# EAGLE schematic CrackberryPi_1.0.4 (EAGLE 6.5.0)
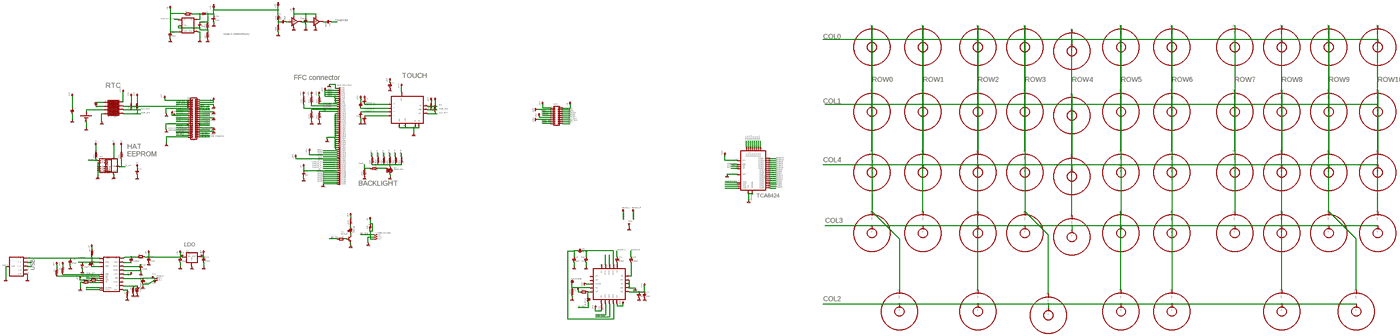
[diagram p0: schematic, sheet 1, overview]
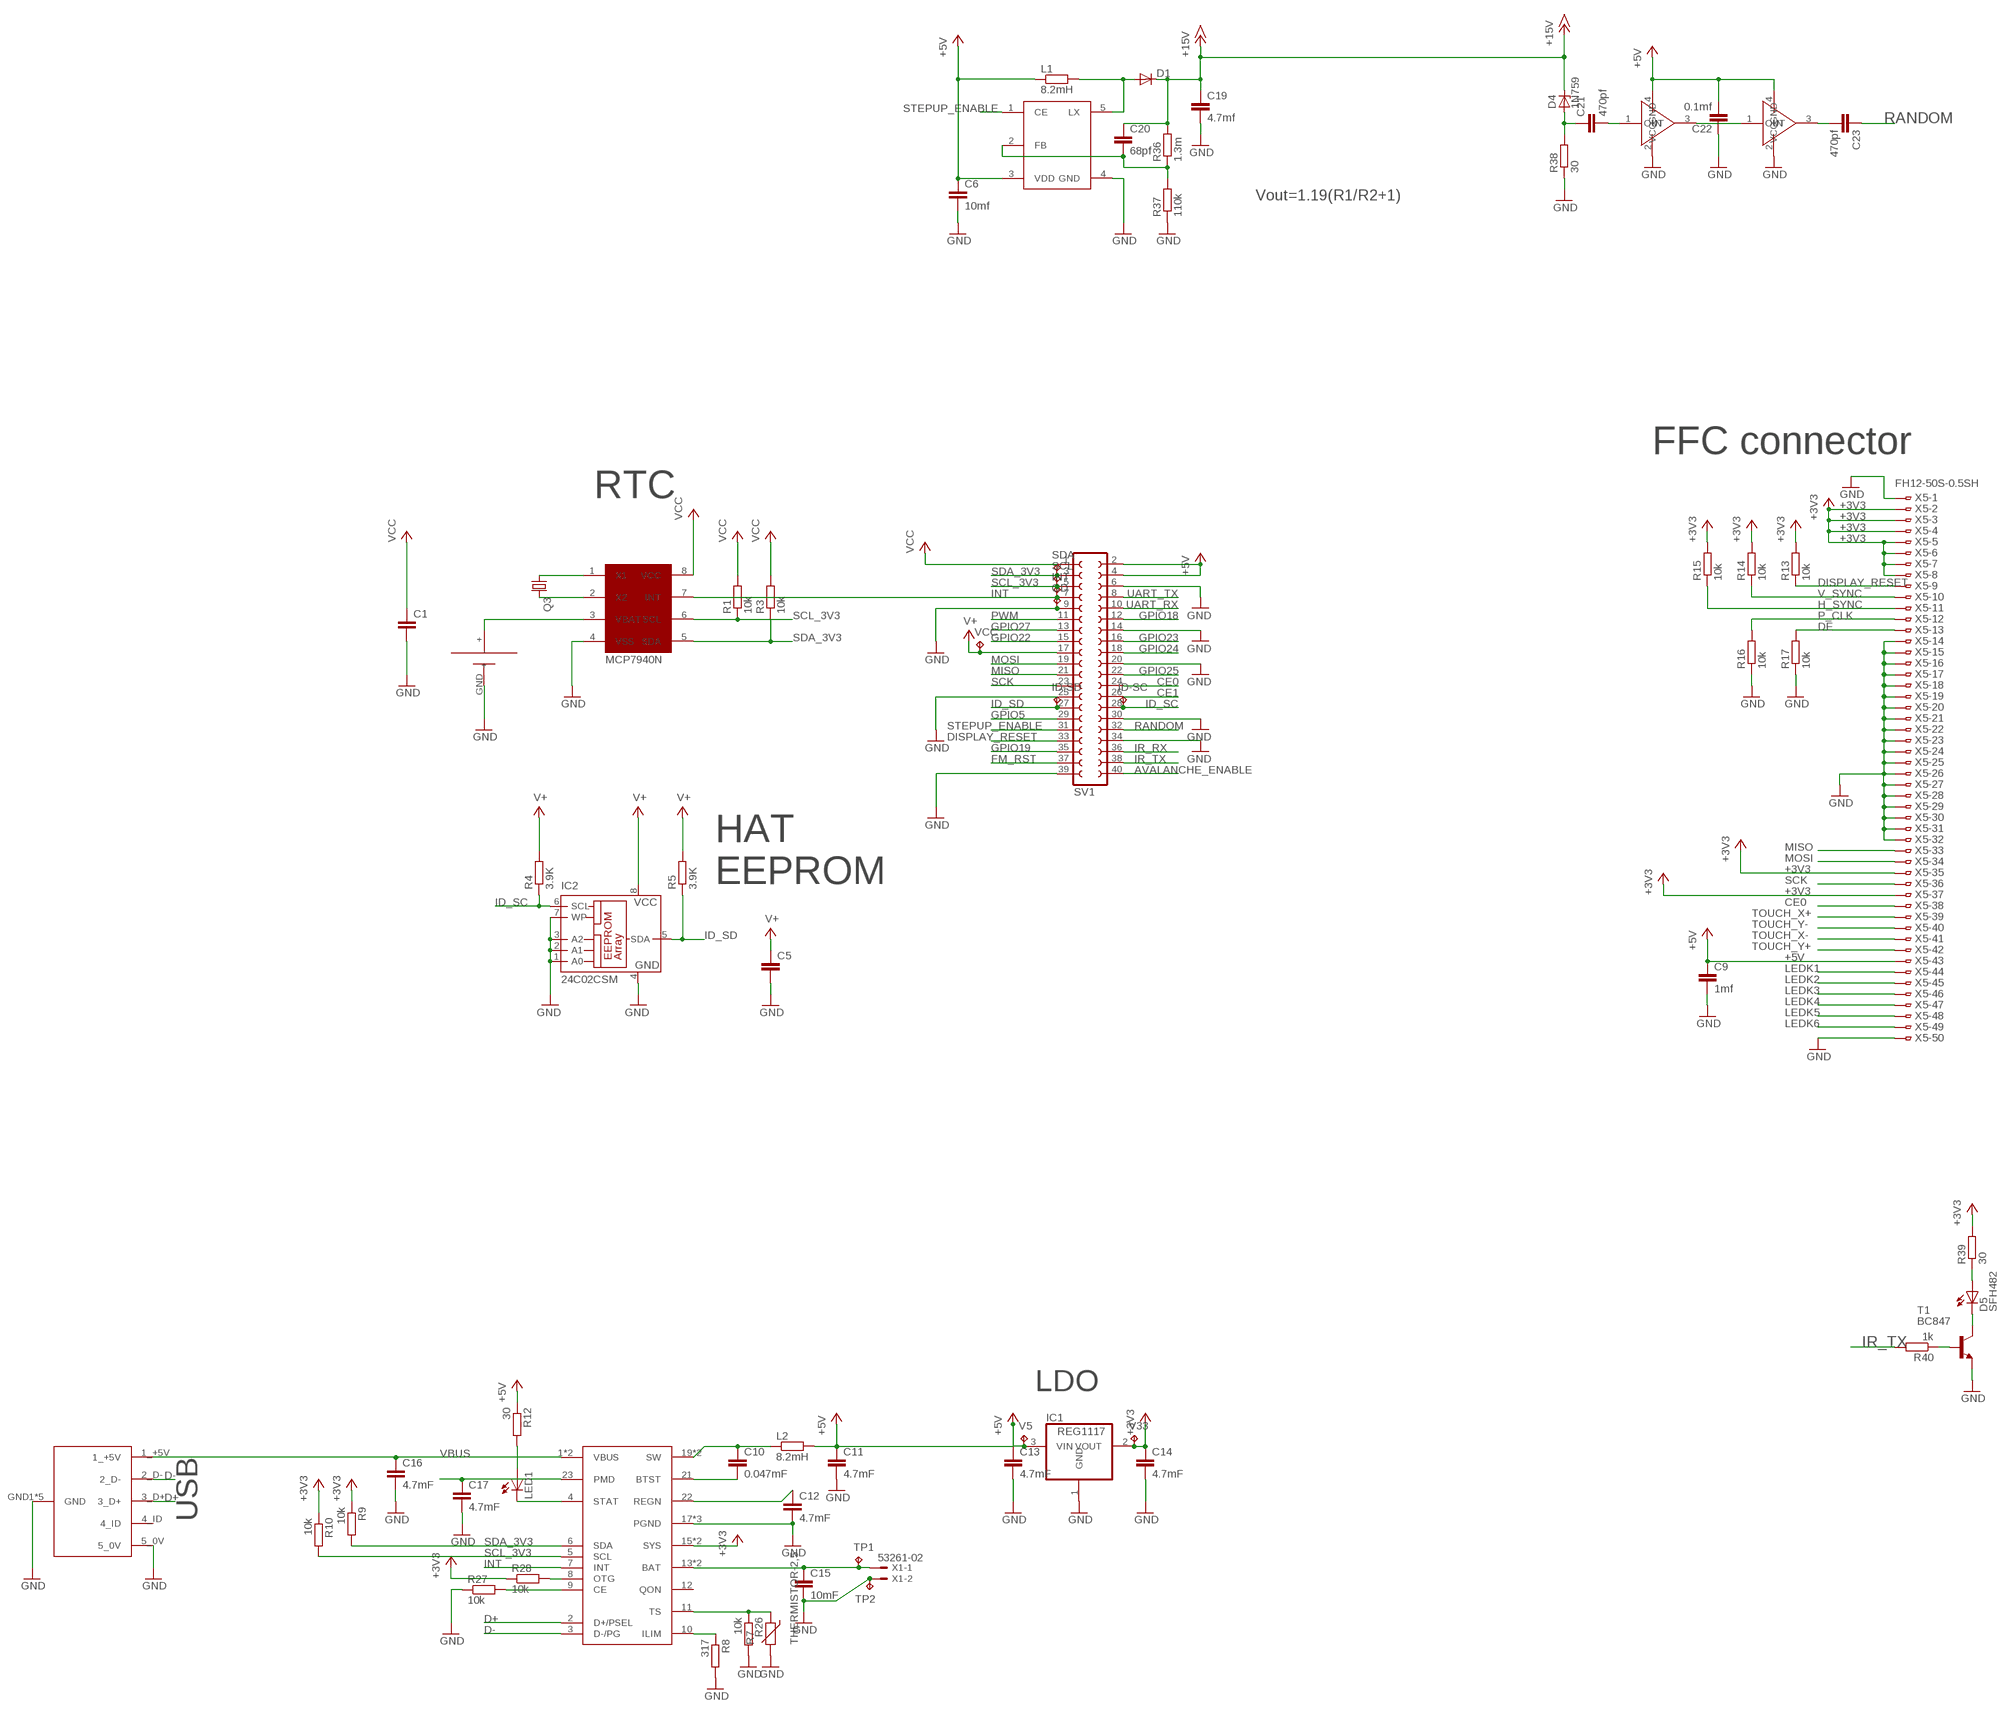
[diagram p1: schematic, sheet 1, part 1 of 4]
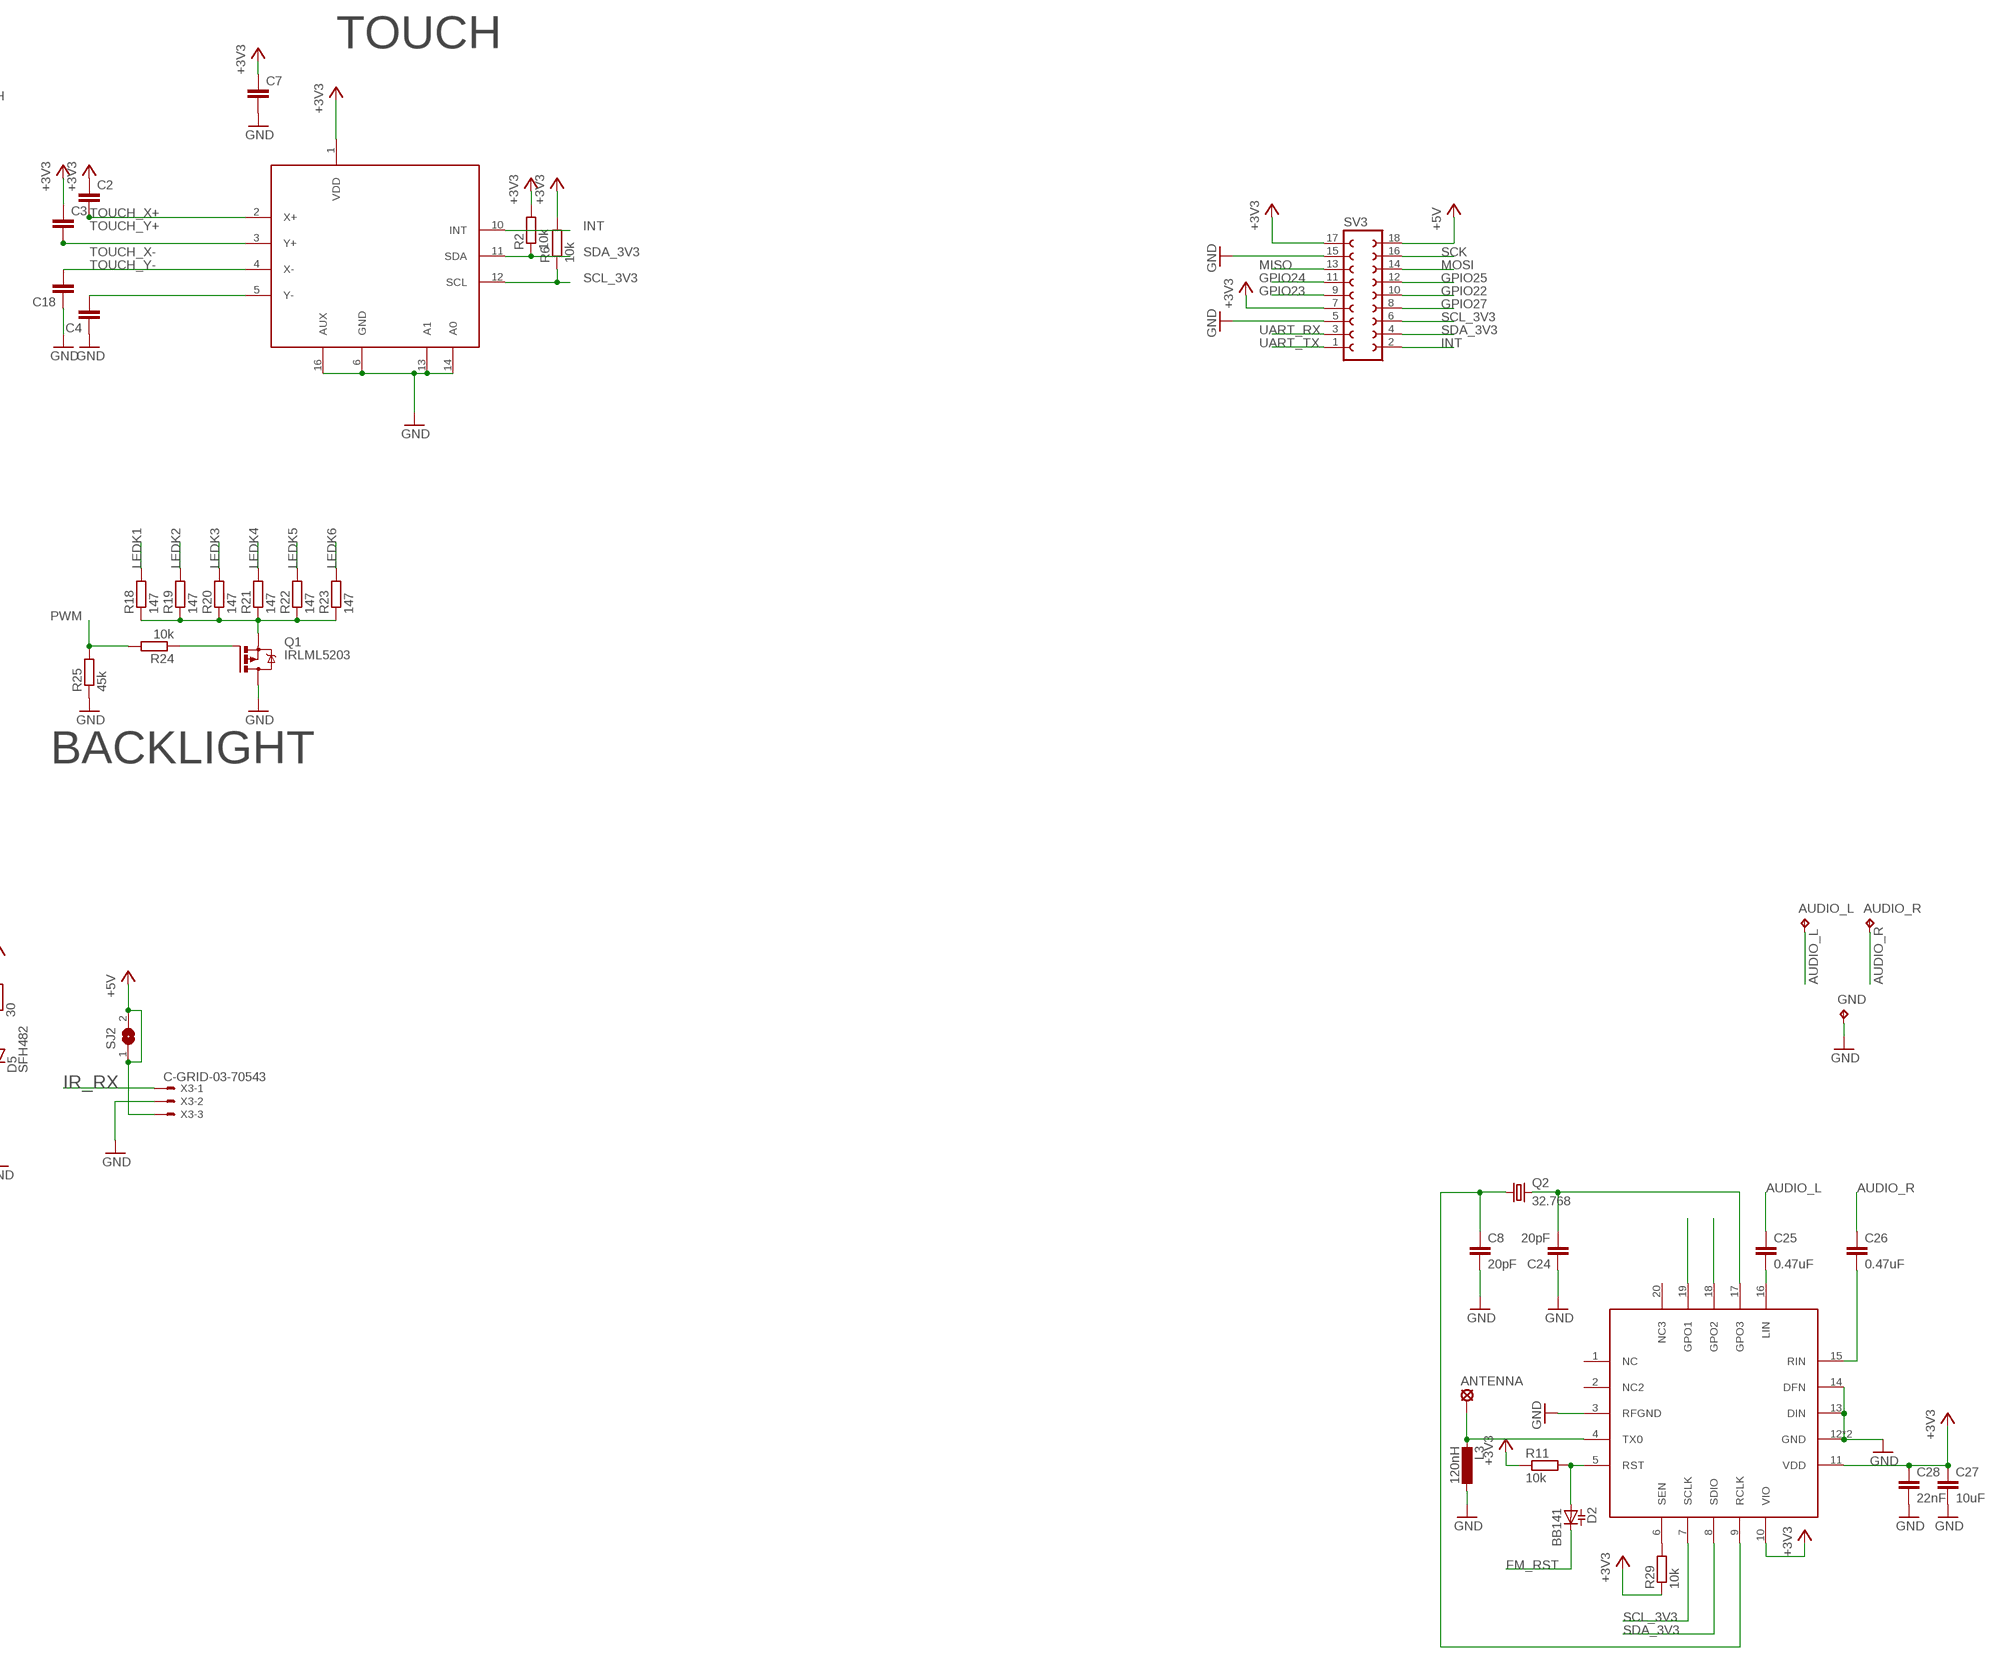
[diagram p2: schematic, sheet 1, part 2 of 4]
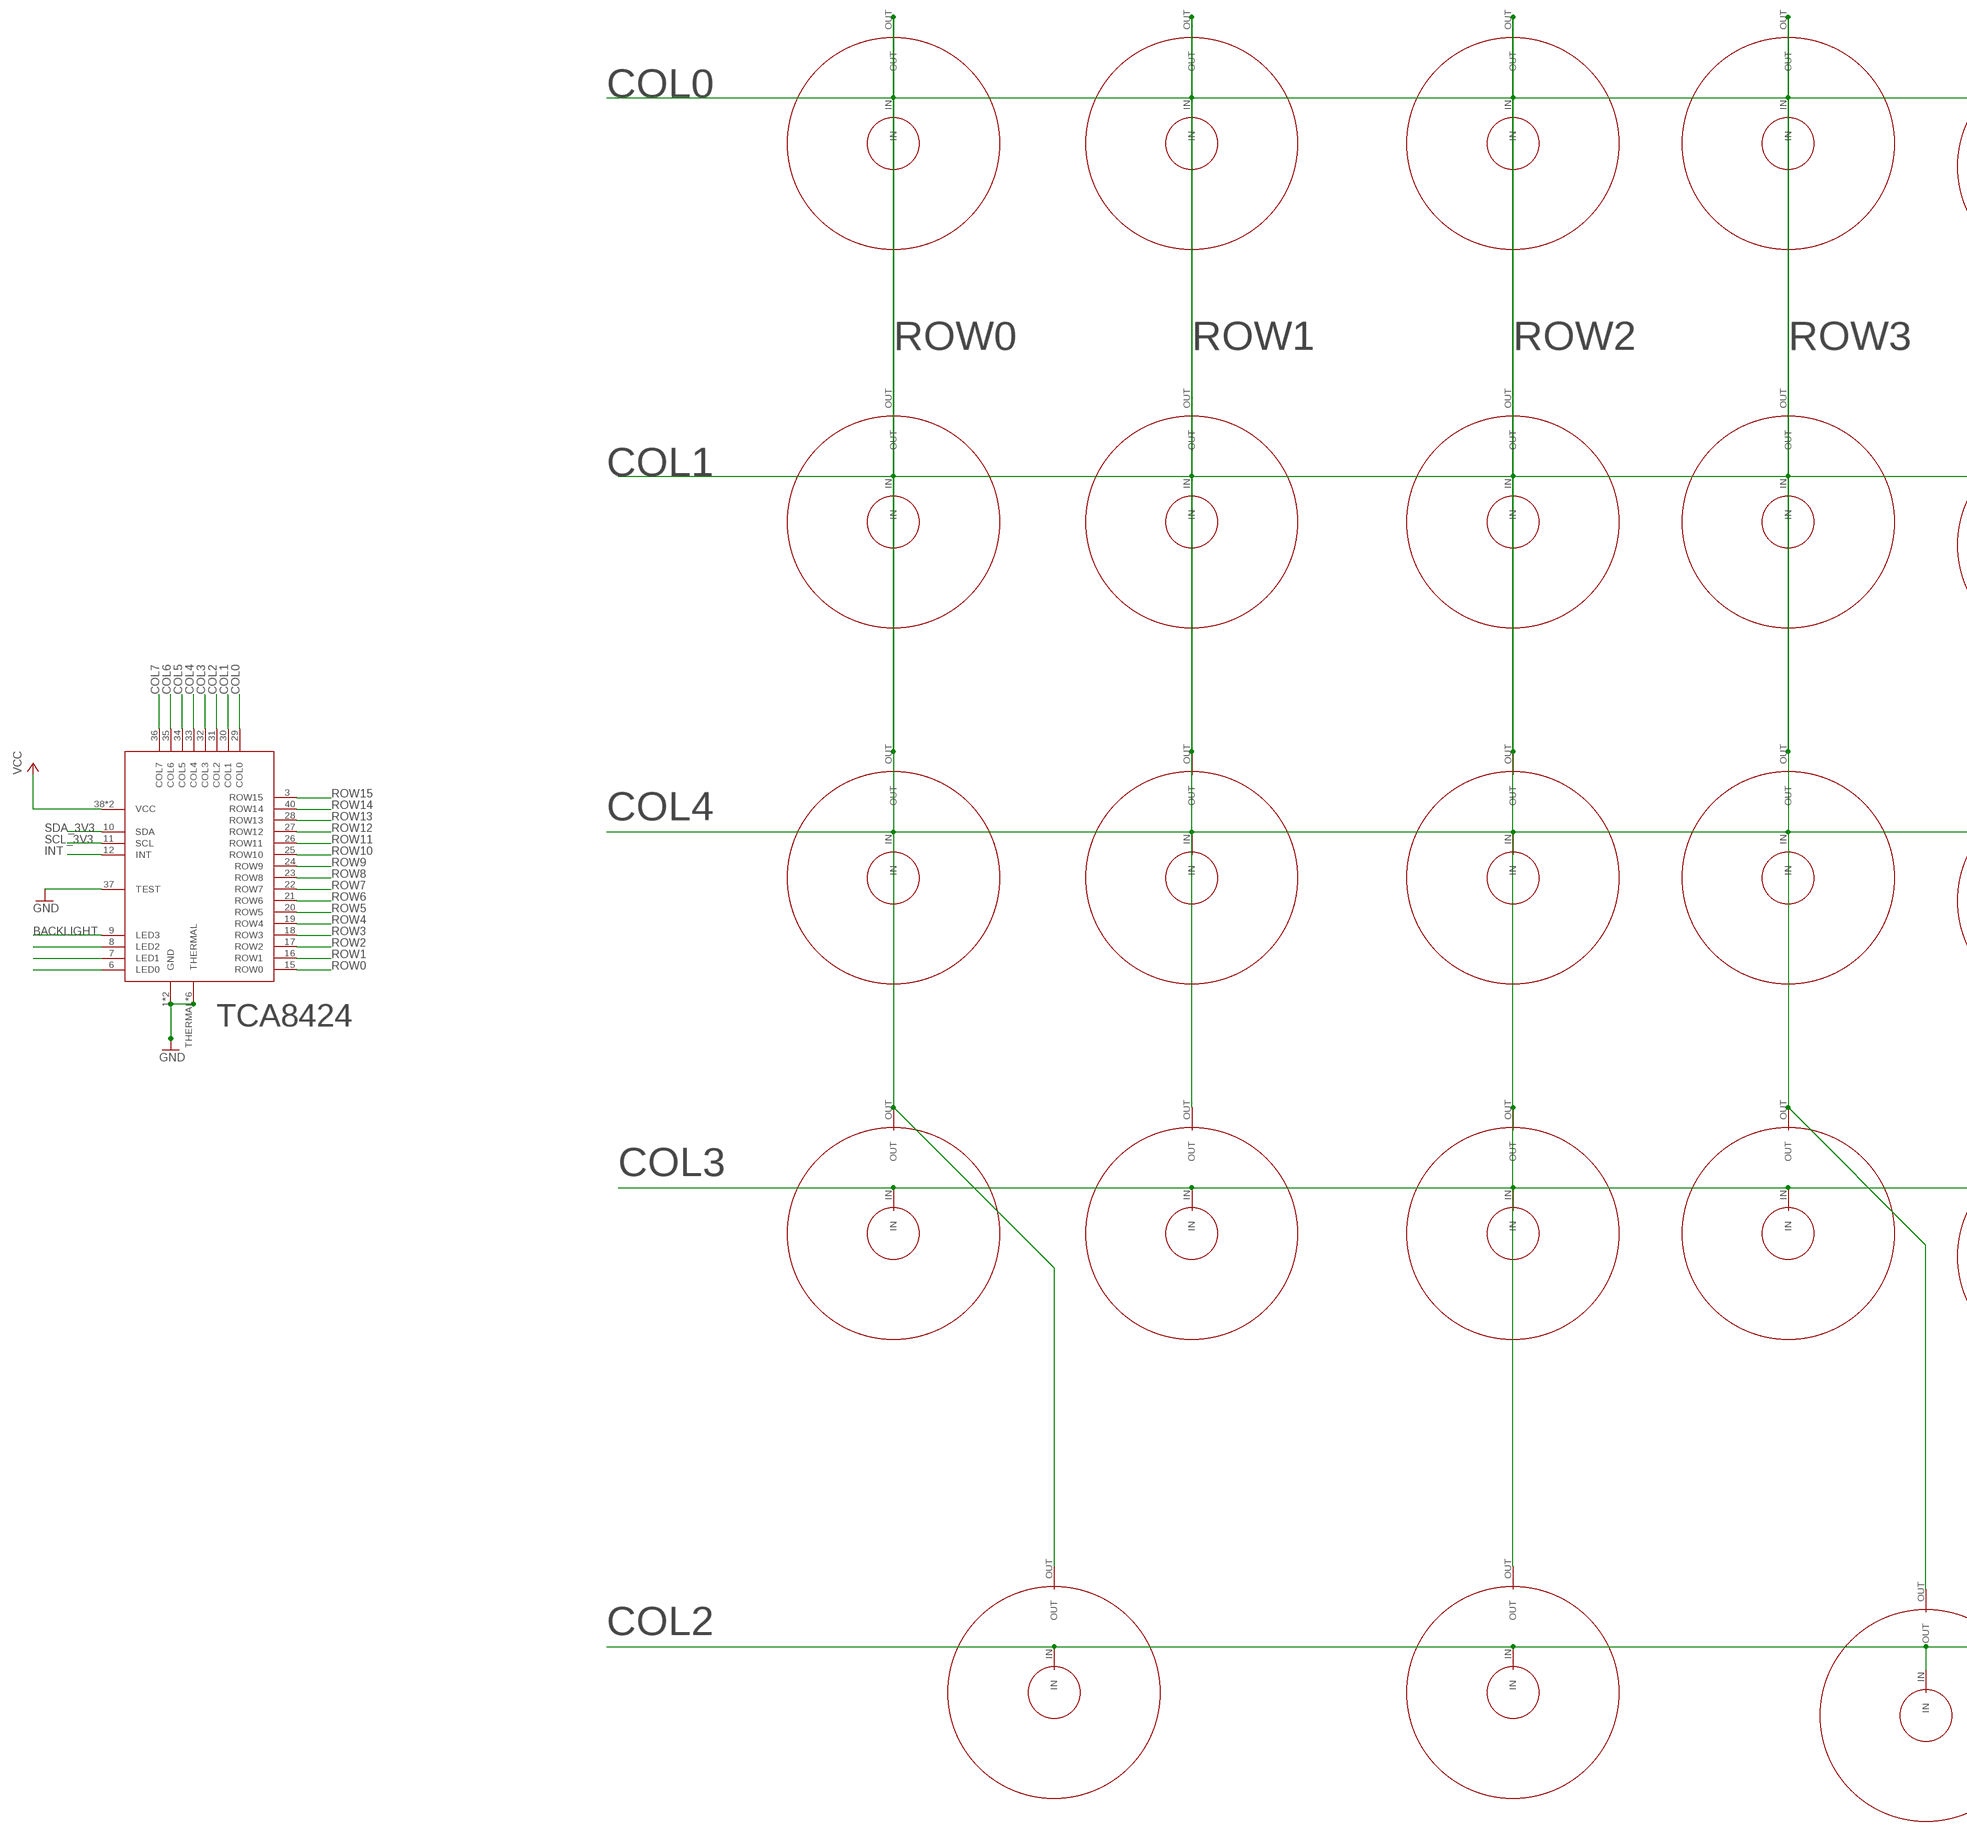
[diagram p3: schematic, sheet 1, part 3 of 4]
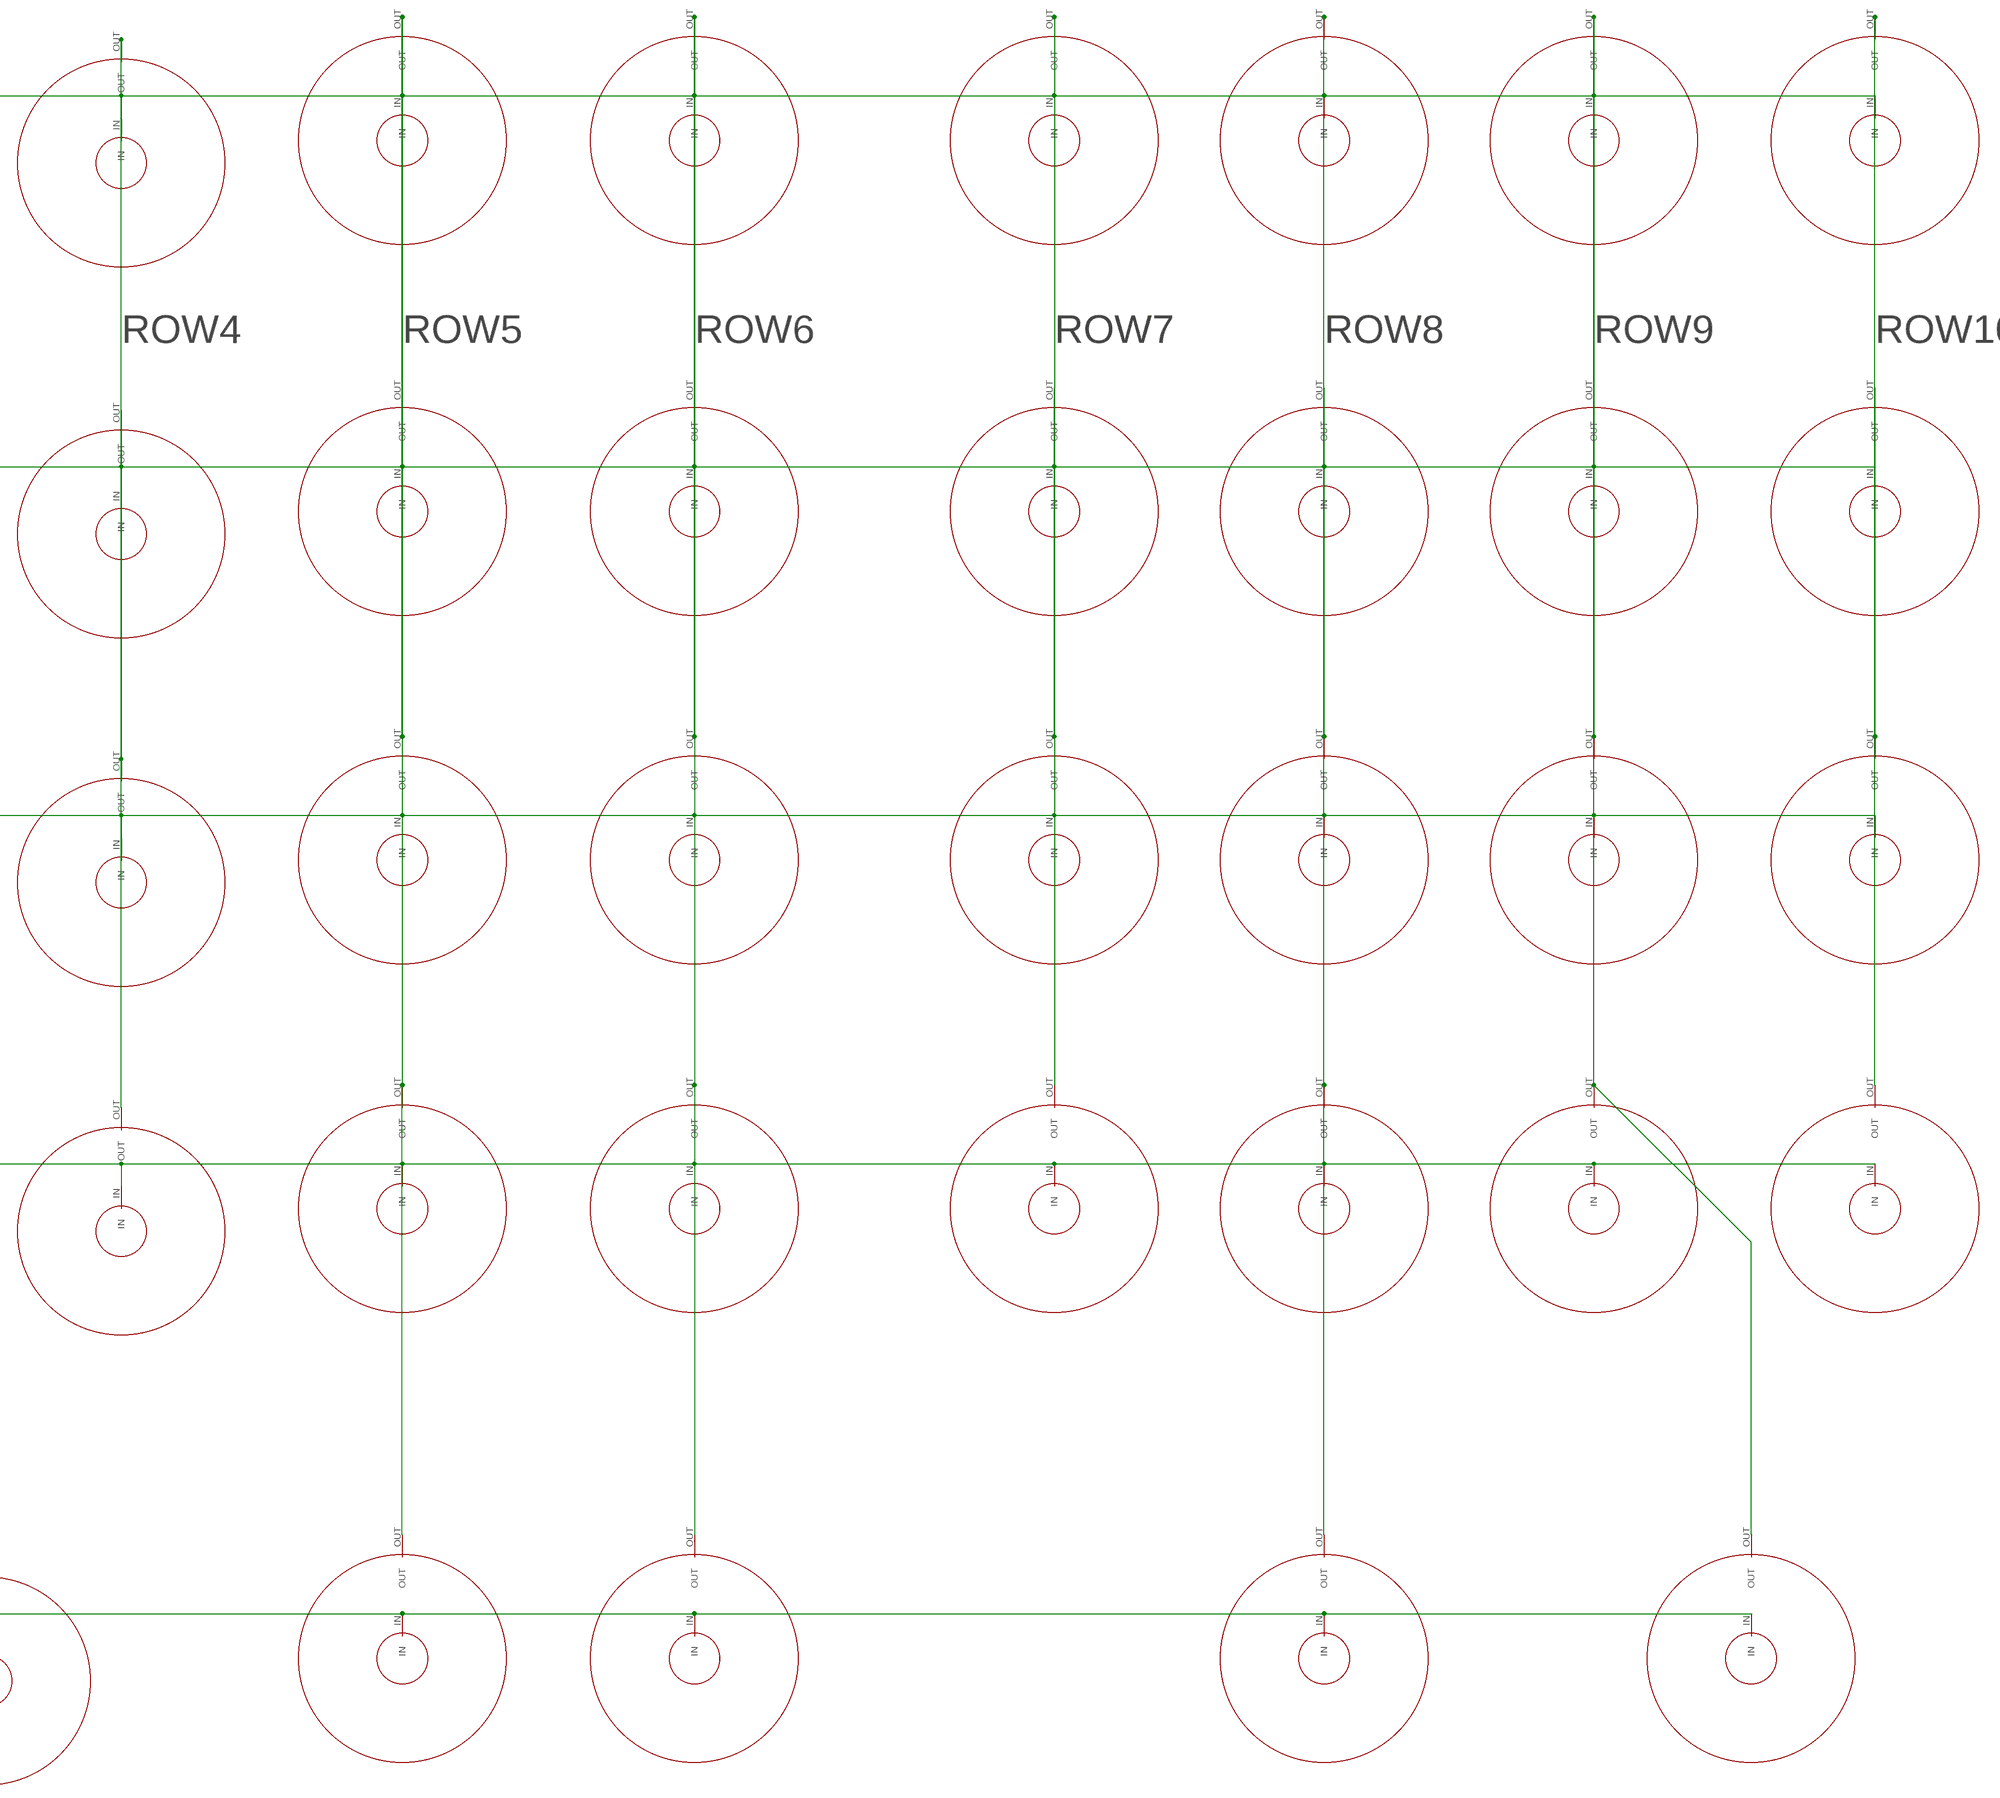
[diagram p4: schematic, sheet 1, part 4 of 4]

## Parts
0  DOME  [4MM]
1  DOME  [4MM]
2  DOME  [4MM]
3  DOME  [4MM]
4  DOME  [4MM]
5  DOME  [4MM]
6  DOME  [4MM]
7  DOME  [4MM]
8  DOME  [4MM]
9  DOME  [4MM]
!  DOME  [4MM]
(  DOME  [4MM]
)  DOME  [4MM]
+  DOME  [4MM]
,  DOME  [4MM]
-  DOME  [4MM]
.  DOME  [4MM]
?  DOME  [4MM]
@  DOME  [4MM]
A  DOME  [4MM]
ANTENNA  LSP10  [LSP10]
AUDIO_L  TPB2,54  [B2,54]
AUDIO_R  TPB2,54  [B2,54]
B  DOME  [4MM]
C  DOME  [4MM]
C1  C-EUC0603  [C0603]
C2  C-EUC0603  [C0603]
C3  C-EUC0603  [C0603]
C4  C-EUC0603  [C0603]
C5  C-EUC0603  [C0603]
C6  10mf  C-EUC0603  [C0603]
C7  C-EUC0603  [C0603]
C8  20pF  C-EUC0603  [C0603]
C9  1mf  C-EUC0603  [C0603]
C10  0.047mF  C-EUC0603  [C0603]
C11  4.7mF  C-EUC0603  [C0603]
C12  4.7mF  C-EUC0603  [C0603]
C13  4.7mF  C-EUC0603  [C0603]
C14  4.7mF  C-EUC0603  [C0603]
C15  10mF  C-EUC0603  [C0603]
C16  4.7mF  C-EUC0603  [C0603]
C17  4.7mF  C-EUC0603  [C0603]
C18  C-EUC0603  [C0603]
C19  4.7mf  C-EUC0603  [C0603]
C20  68pf  C-EUC0603  [C0603]
C21  470pf  C-EUC0603  [C0603]
C22  0.1mf  C-EUC0603  [C0603]
C23  470pf  C-EUC0603  [C0603]
C24  20pF  C-EUC0603  [C0603]
C25  0.47uF  C-EUC0603  [C0603]
C26  0.47uF  C-EUC0603  [C0603]
C27  10uF  C-EUC0603  [C0603]
C28  22nF  C-EUC0603  [C0603]
D  DOME  [4MM]
D1  DIODE-SOD123  [SOD123]
D2  BB141  [SOD523]
D4  1N759  ZENER-DIODESOD80C  [SOD80C]
D5  SFH482  [SFH482]
E  DOME  [4MM]
F  DOME  [4MM]
FN-RIGHT  DOME  [4MM]
G  DOME  [4MM]
GD  TPB1,27  [B1,27]
GND  TPB2,54  [B2,54]
H  DOME  [4MM]
I  DOME  [4MM]
IC1  REG1117  [SOT223]
IC2  24C02CSM  [SO-08M]
ID-SC  TPB1,27  [B1,27]
ID-SD  TPB1,27  [B1,27]
INT  TPB1,27  [B1,27]
J  DOME  [4MM]
K  DOME  [4MM]
L  DOME  [4MM]
L1  8.2mH  R-EU_R1206W  [R1206W]
L2  8.2mH  R-EU_R1206W  [R1206W]
L3  120nH  L-EUL2012C  [L2012C]
LED1  LEDSML0603  [SML0603]
M  DOME  [4MM]
N  DOME  [4MM]
O  DOME  [4MM]
P  DOME  [4MM]
Q  DOME  [4MM]
Q1  IRLML5203  [MICRO3]
Q2  32.768  CRYSTALMM20SS  [MM20SS]
Q3  CRYSTALMM20SS  [MM20SS]
R  DOME  [4MM]
R1  10k  R-EU_R0603  [R0603]
R2  10k  R-EU_R0603  [R0603]
R3  10k  R-EU_R0603  [R0603]
R4  3.9K  R-EU_R0603  [R0603]
R5  3.9K  R-EU_R0603  [R0603]
R6  10k  R-EU_R0603  [R0603]
R7  THERMISTOR-2,5  [RS-2,5]
R8  317  R-EU_R0603  [R0603]
R9  10k  R-EU_R0603  [R0603]
R10  10k  R-EU_R0603  [R0603]
R11  10k  R-EU_R0603  [R0603]
R12  30  R-EU_R0603  [R0603]
R13  10k  R-EU_R0603  [R0603]
R14  10k  R-EU_R0603  [R0603]
R15  10k  R-EU_R0603  [R0603]
R16  10k  R-EU_R0603  [R0603]
R17  10k  R-EU_R0603  [R0603]
R18  147  R-EU_R0603  [R0603]
R19  147  R-EU_R0603  [R0603]
R20  147  R-EU_R0603  [R0603]
R21  147  R-EU_R0603  [R0603]
R22  147  R-EU_R0603  [R0603]
R23  147  R-EU_R0603  [R0603]
R24  10k  R-EU_R0603  [R0603]
R25  45k  R-EU_R0603  [R0603]
R26  10k  R-EU_R0603  [R0603]
R27  10k  R-EU_R0603  [R0603]
R28  10k  R-EU_R0603  [R0603]
R29  10k  R-EU_R0603  [R0603]
R36  1.3m  R-EU_R0603  [R0603]
R37  110k  R-EU_R0603  [R0603]
R38  30  R-EU_R0603  [R0603]
R39  30  R-EU_R0603  [R0603]
R40  1k  R-EU_R0603  [R0603]
S  DOME  [4MM]
SCL  TPB1,27  [B1,27]
SDA  TPB1,27  [B1,27]
SHIFT-RIGHT  DOME  [4MM]
SHILFT-LEFT  DOME  [4MM]
SJ2  SJ  [SJ]
SPACE1  DOME  [4MM]
SPACE2  DOME  [4MM]
SPACE3  DOME  [4MM]
SV1  FE20-2  [FE20-2]
SV3  FE09-2  [FE09-2]
T  DOME  [4MM]
T1  BC847  [SOT23]
TP1  TPTP20SQ  [TP20SQ]
TP2  TPTP20SQ  [TP20SQ]
U  DOME  [4MM]
U$1  BQ24297  [VQFN-4X4-24]
U$2  NCP1406  [SOT23-5L]
U$3  MAX2650  [SOT143-W]
U$4  CR1216  [CR1216]
U$5  MCP7940N  [SO08]
U$6  TSC2007  [TSSOP16]
U$7  TCA8424  [QFN40]
U$8  SI4713  [QFN20-3X3]
U$9  MICRO_USB  [MICRO_USB]
U$10  MAX2650  [SOT143-W]
V  DOME  [4MM]
V5  TPB1,27  [B1,27]
V33  TPB1,27  [B1,27]
VCC  TPB1,27  [B1,27]
W  DOME  [4MM]
X  DOME  [4MM]
X1  53261-02  [53261-02]
X3  C-GRID-03-70543  [70543-03]
X5  FH12-50S-0.5SH  [FH12-50S-0.5SH]
Y  DOME  [4MM]
Z  DOME  [4MM]

## Nets
+3V3: C2.1 C3.1 C7.1 C14.1 C27.1 C28.1 IC1.2(VOUT) R2.2 R6.2 R9.1 R10.1 R11.1 R13.2 R14.2 R15.2 R28.1 R29.1 R39.2 SV3.7 SV3.17 U$1.15(SYS) U$1.16(SYS) U$6.1(VDD) U$8.10(VIO) U$8.11(VDD) V33.TP X5.2 X5.3 X5.4 X5.5 X5.6 X5.7 X5.8 X5.35 X5.37
+5V: C6.1 C9.1 C11.1 C13.1 C22.2 IC1.3(VIN) L1.1 L2.2 R12.1 SJ2.1 SJ2.2 SV1.2 SV1.4 SV3.18 U$2.3(VDD) U$3.4(VCC) U$10.4(VCC) V5.TP X3.3 X5.43
+15V: C19.1 C20.1 D1.C D4.C R36.2
AUDIO_L: AUDIO_L.TP C25.1
AUDIO_R: AUDIO_R.TP C26.1
AVALANCHE_ENABLE: SV1.40
BACKLIGHT: U$7.9(LED3)
BASE: R40.1 T1.1(B)
CE0: SV1.24 X5.38
CE1: SV1.26
COL0: 0.IN 1.IN 2.IN 3.IN 4.IN 5.IN 6.IN 7.IN 8.IN 9.IN -.IN U$7.29(COL0)
COL1: +.IN E.IN I.IN O.IN P.IN Q.IN R.IN T.IN U$7.30(COL1) U.IN W.IN Y.IN
COL2: @.IN FN-RIGHT.IN SHIFT-RIGHT.IN SHILFT-LEFT.IN SPACE1.IN SPACE2.IN SPACE3.IN U$7.31(COL2)
COL3: !.IN ,.IN ..IN ?.IN B.IN C.IN M.IN N.IN U$7.32(COL3) V.IN X.IN Z.IN
COL4: (.IN ).IN A.IN D.IN F.IN G.IN H.IN J.IN K.IN L.IN S.IN U$7.33(COL4)
COL5: U$7.34(COL5)
COL6: U$7.35(COL6)
COL7: U$7.36(COL7)
COLLECTOR: D5.K(C) T1.3(C)
D+: U$1.2(D+/PSEL) U$9.3_D+
D-: U$1.3(D-/PG) U$9.2_D-
DE: R17.2 X5.13
DISPLAY_RESET: R13.1 SV1.33 X5.9
EMITTER: T1.2(E) ; supply symbol labelled GND
FB: C20.2 R36.1 R37.2 U$2.2(FB)
FM_RST: D2.C SV1.37
GND: C1.2 C4.1 C5.2 C6.2 C7.2 C8.2 C9.2 C11.2 C12.2 C13.2 C14.2 C15.2 C16.2 C17.2 C18.1 C19.2 C22.1 C24.1 C27.2 C28.2 GD.TP GND.TP IC1.1(GND) IC2.1(A0) IC2.2(A1) IC2.3(A2) IC2.4(GND) IC2.7(WP) L3.1 Q1.3(D) R7.2 R8.2 R16.1 R17.1 R25.1 R26.2 R27.1 R37.1 R38.1 SV1.6 SV1.9 SV1.14 SV1.20 SV1.25 SV1.30 SV1.34 SV1.39 SV3.5 SV3.15 TP2.TP U$1.17(PGND) U$1.18(PGND) U$1.P$1(PGND) U$2.4(GND) U$3.2(GND) U$4.GND(-) U$5.4(VSS) U$6.6(GND) U$6.13(A1) U$6.14(A0) U$6.16(AUX) U$7.1(GND) U$7.4(GND) U$7.37(TEST) U$7.THERMAL U$7.VIA1(THERMAL) U$7.VIA2(THERMAL) U$7.VIA3(THERMAL) U$7.VIA4(THERMAL) U$7.VIA5(THERMAL) U$8.3(RFGND) U$8.12(GND) U$8.13(DIN) U$8.14(DFN) U$8.P$1(GND) U$9.5_0V U$9.GND1(GND) U$9.GND2(GND) U$9.GND5(GND) U$9.P$1(GND) U$9.P$7(GND) U$10.2(GND) X1.2 X3.2 X5.1 X5.14 X5.15 X5.16 X5.17 X5.18 X5.19 X5.20 X5.21 X5.22 X5.23 X5.24 X5.25 X5.26 X5.27 X5.28 X5.29 X5.30 X5.31 X5.32 X5.50
GPIO5: SV1.29
GPIO18: SV1.12
GPIO19: SV1.35
GPIO22: SV1.15 SV3.10
GPIO23: SV1.16 SV3.9
GPIO24: SV1.18 SV3.11
GPIO25: SV1.22 SV3.12
GPIO27: SV1.13 SV3.8
GPO1: U$8.19(GPO1)
GPO2: U$8.18(GPO2)
H_SYNC: R15.1 X5.11
ID_SC: IC2.6(SCL) ID-SC.TP R4.1 SV1.28
ID_SD: IC2.5(SDA) ID-SD.TP R5.1 SV1.27
IN_1: C21.2 U$3.1(IN)
INT: INT.TP SV1.7 SV3.2 U$1.7(INT) U$5.7(INT) U$6.10(INT) U$7.12(INT)
IR_RX: SV1.36 X3.1
IR_TX: R40.2 SV1.38
LEDK1: R18.2 X5.44
LEDK2: R19.2 X5.45
LEDK3: R20.2 X5.46
LEDK4: R21.2 X5.47
LEDK5: R22.2 X5.48
LEDK6: R23.2 X5.49
LX: D1.A L1.2 U$2.5(LX)
MISO: SV1.21 SV3.13 X5.33
MOSI: SV1.19 SV3.14 X5.34
N$1: C10.1 L2.1 U$1.19(SW) U$1.20(SW)
N$2: C10.2 U$1.21(BTST)
N$3: C15.1 TP1.TP U$1.13(BAT) U$1.14(BAT) X1.1
N$4: LED1.A R12.2
N$5: C12.1 U$1.22(REGN)
N$6: R7.1 R26.1 U$1.11(TS)
N$7: R8.1 U$1.10(ILIM)
N$8: C17.1 U$1.23(PMD)
N$9: LED1.C U$1.4(STAT)
N$10: U$7.6(LED0)
N$11: Q3.1 U$5.1(X1)
N$12: Q1.2(S) R18.1 R19.1 R20.1 R21.1 R22.1 R23.1
N$13: Q3.4 U$5.2(X2)
N$14: U$7.7(LED1)
N$15: R27.2 U$1.9(CE)
N$16: C21.1 D4.A R38.2
N$17: R28.2 U$1.8(OTG)
N$18: U$7.8(LED2)
N$19: C24.2 Q2.4 U$8.17(GPO3)
N$20: Q1.1(G) R24.1
N$21: C8.1 Q2.1 U$8.9(RCLK)
N$22: C25.2 U$8.16(LIN)
N$23: C26.2 U$8.15(RIN)
N$24: D2.A R11.2 U$8.5(RST)
N$25: ANTENNA.MP L3.2 U$8.4(TX0)
N$26: R29.2 U$8.6(SEN)
N$30: D5.A R39.1
OUT1_IN2: U$3.3(OUT) U$10.1(IN)
OUT2: C23.2 U$10.3(OUT)
P_CLK: R16.2 X5.12
PWM: R24.2 R25.2 SV1.11
RANDOM: C23.1 SV1.32
ROW0: 1.OUT A.OUT Q.OUT SHILFT-LEFT.OUT U$7.15(ROW0) Z.OUT
ROW1: 2.OUT S.OUT U$7.16(ROW1) W.OUT X.OUT
ROW2: 3.OUT C.OUT D.OUT E.OUT SPACE1.OUT U$7.17(ROW2)
ROW3: 4.OUT F.OUT R.OUT SPACE2.OUT U$7.18(ROW3) V.OUT
ROW4: 5.OUT B.OUT G.OUT T.OUT U$7.19(ROW4)
ROW5: 6.OUT H.OUT N.OUT SPACE3.OUT U$7.20(ROW5) Y.OUT
ROW6: 7.OUT J.OUT M.OUT SHIFT-RIGHT.OUT U$7.21(ROW6) U.OUT
ROW7: 8.OUT ?.OUT I.OUT K.OUT U$7.22(ROW7)
ROW8: 9.OUT !.OUT @.OUT L.OUT O.OUT U$7.23(ROW8)
ROW9: 0.OUT (.OUT ,.OUT FN-RIGHT.OUT P.OUT U$7.24(ROW9)
ROW10: ).OUT +.OUT -.OUT ..OUT U$7.25(ROW10)
ROW11: U$7.26(ROW11)
ROW12: U$7.27(ROW12)
ROW13: U$7.28(ROW13)
ROW14: U$7.40(ROW14)
ROW15: U$7.3(ROW15)
SCK: SV1.23 SV3.16 X5.36
SCL_3V3: R1.1 R6.1 R10.2 SCL.TP SV1.5 SV3.6 U$1.5(SCL) U$5.6(SCL) U$6.12(SCL) U$7.11(SCL) U$8.7(SCLK)
SDA_3V3: R2.1 R3.1 R9.2 SDA.TP SV1.3 SV3.4 U$1.6(SDA) U$5.5(SDA) U$6.11(SDA) U$7.10(SDA) U$8.8(SDIO)
STEPUP_ENABLE: SV1.31 U$2.1(CE)
TOUCH_X+: C2.2 U$6.2(X+) X5.39
TOUCH_X-: C18.2 U$6.4(X-) X5.41
TOUCH_Y+: C3.2 U$6.3(Y+) X5.42
TOUCH_Y-: C4.2 U$6.5(Y-) X5.40
UART_RX: SV1.10 SV3.3
UART_TX: SV1.8 SV3.1
V+: C5.1 IC2.8(VCC) R4.2 R5.2 SV1.17 VCC.TP
V_SYNC: R14.1 X5.10
VBAT+: U$4.+ U$5.3(VBAT)
VBUS: C16.1 U$1.1(VBUS) U$1.24(VBUS) U$9.1_+5V
VCC: C1.1 R1.2 R3.2 SV1.1 U$5.8(VCC) U$7.38(VCC) U$7.39(VCC)
Unconnected: U$1.12(QON) U$8.1(NC) U$8.2(NC2) U$8.20(NC3) U$9.4_ID

## Notes on the sheet
- Vout=1.19(R1/R2+1)
- FFC connector | TOUCH
- RTC
- MCP7940N
- HAT
  EEPROM
- BACKLIGHT
- TCA8424
- LDO
- USB

## Library data of the parts
0 1-9 ! ( ) + , - . ? @ A B C D E F FN-RIGHT G H I J K L M N O P Q R S SHIFT-RIGHT SHILFT-LEFT SPACE1-SPACE3 T U V W X Y Z = DOME:DOME
ANTENNA = solpad:LSP10: SOLDER PAD drill 1.0 mm, distributor Buerklin, 12H555
AUDIO_L AUDIO_R GD GND ID-SC ID-SD INT SCL SDA TP1 TP2 V5 V33 VCC = testpad:TP: Test pad
C1-C28 = rcl:C-EU: CAPACITOR, European symbol
D1 = diode:DIODE-: DIODE
D2 = diode:BB141: Capacity DIODE variable-capacitance diode
D4 = diode:ZENER-DIODE: Z-Diode
D5 = led:SFH482: IR LED infrared emitting diode, Infineon
IC1 = burr-brown:REG1117: 800mA and 1A Low Dropout (LDO) Positive Regulator 1.8V, 2.5V, 2.85V, 3.3V, 5V, and Adj; MPN: REG1117; OC_FARNELL: 1097566; OC_NEWARK: 14P6981
IC2 = microchip:24C*: Serial EEPROM 1 K/2 K/4 K; MF: MICROCHIP; MPN: 24C02C-I/SN; OC_FARNELL: 1084339; OC_NEWARK: 96K4063
L1 L2 R1-R6 R8-R29 R36-R40 = rcl:R-EU_: RESISTOR, European symbol
L3 = rcl:L-EU: INDUCTOR, European symbol
LED1 = led:LED: LED OSRAM: - CHIPLED LG R971, LG N971, LY N971, LG Q971, LY Q971, LO R971, LY R971 LH N974, LH R974 LS Q976, LO Q976, LY Q976 LO Q996 - Hyper CHIPLED LW Q18S LB Q993, LB Q99A, LB R99A - SideLED LS A670, LO A670, LY A670, LG A670, LP A670 LB A673, LV A673, LT A673, LW A673 LH A674 LY A675 LS A676, LA A676, LO A676, LY A676, LW A676 LS A679, LY A679, LG A679 - Hyper Micro SIDELED® LS Y876, LA Y876, LO Y876, LY Y876 LT Y87S - SmartLED LW L88C, LW L88S LB L89C, LB L89S, LG L890 LS L89K, LO L89K, LY L89K LS L896, LA L896, LO L896, LY L896 - TOPLED LS T670, LO T670, LY T670, LG T670, LP T670 LSG T670, LSP T670, LSY T670, LOP T670, LYG T670 LG T671, LOG T671, LSG T671 LB T673, LV T673, LT T673, LW T673 LH T674 LS T676, LA T676, LO T676, LY T676, LB T676, LH T676, LSB T676, LW T676 LB T67C, LV T67C, LT T67C, LS T67K, LO T67K, LY T67K, LW E67C LS E67B, LA E67B, LO E67B, LY E67B, LB E67C, LV E67C, LT E67C LW T67C LS T679, LY T679, LG T679 LS T770, LO T770, LY T770, LG T770, LP T770 LB T773, LV T773, LT T773, LW T773 LH T774 LS E675, LA E675, LY E675, LS T675 LS T776, LA T776, LO T776, LY T776, LB T776 LHGB T686 LT T68C, LB T68C - Hyper Mini TOPLED® LB M676 - Mini TOPLED Santana® LG M470 LS M47K, LO M47K, LY M47K Source: http://www.osram.convergy.de LUXEON: - LUMILED® LXK2-PW12-R00, LXK2-PW12-S00, LXK2-PW14-U00, LXK2-PW14-V00 LXK2-PM12-R00, LXK2-PM12-S00, LXK2-PM14-U00 LXK2-PE12-Q00, LXK2-PE12-R00, LXK2-PE12-S00, LXK2-PE14-T00, LXK2-PE14-U00 LXK2-PB12-K00, LXK2-PB12-L00, LXK2-PB12-M00, LXK2-PB14-N00, LXK2-PB14-P00, LXK2-PB14-Q00 LXK2-PR12-L00, LXK2-PR12-M00, LXK2-PR14-Q00, LXK2-PR14-R00 LXK2-PD12-Q00, LXK2-PD12-R00, LXK2-PD12-S00 LXK2-PH12-R00, LXK2-PH12-S00 LXK2-PL12-P00, LXK2-PL12-Q00, LXK2-PL12-R00 Source: www.luxeon.com KINGBRIGHT: KA-3528ASYC Source: www.kingbright.com
Q1 = transistor-power:IRLML5203: HEXFET P-Channel Power MOSFET
Q2 Q3 = crystal:CRYSTAL: CRYSTAL; OC_FARNELL: unknown; OC_NEWARK: unknown
R7 = varistor:THERMISTOR: THERMISTOR
SJ2 = jumper:SJ: SMD solder JUMPER
SV1 = con-lsta:FE20-2: FEMALE HEADER; OC_FARNELL: unknown; OC_NEWARK: unknown
SV3 = con-lsta:FE09-2: FEMALE HEADER; OC_FARNELL: unknown; OC_NEWARK: unknown
T1 = transistor:BC847: NPN TRANSISTOR
U$1 = BQ24297:BQ24297
U$2 = ncp1406:NCP1406
U$3 U$10 = max2650:MAX2650
U$4 = cr1216:CR1216
U$5 = MCP7940N:MCP7940N
U$6 = tsc2046:TSC2007
U$7 = TCA8424:TCA8424
U$8 = Si4713:SI4713
U$9 = MICRO_USB:MICRO_USB
X1 = con-molex:53?-02: CONNECTOR wire to board 1.25 mm (.049 inch) pitch header; OC_FARNELL: 1125373; OC_NEWARK: unknown
X3 = con-molex:C-GRID-03: CONNECTOR wire to board 2.54 mm (0.100") pitch header; OC_FARNELL: unknown; OC_NEWARK: unknown
X5 = FCI_62684:FH12-50S-0.5S: 0.5mm Pitch Connectors For FPC/FFC Source: Data sheet <http://www.hirose.co.jp/cataloge_hp/e58605370.pdf>; MPN: FH12-50S-0.5SH(55); OC_FARNELL: 1324557; OC_NEWARK: 34M6181